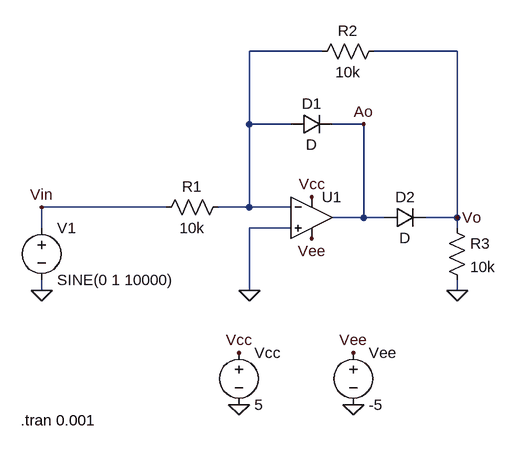
[diagram p0: schematic PrecisionHalfWaveRectifier.asc]
PrecisionHalfWaveRectifier.asc, the LTspice schematic file:
Version 4
SHEET 1 880 680
WIRE 224 -112 112 -112
WIRE 432 -112 304 -112
WIRE 112 0 112 -112
WIRE 176 0 112 0
WIRE 288 0 240 0
WIRE -16 128 -208 128
WIRE 112 128 112 0
WIRE 112 128 64 128
WIRE 176 128 112 128
WIRE 288 144 288 0
WIRE 288 144 240 144
WIRE 320 144 288 144
WIRE 432 144 432 -112
WIRE 432 144 384 144
WIRE -208 160 -208 128
WIRE 176 160 112 160
WIRE 432 160 432 144
WIRE -208 256 -208 240
WIRE 112 256 112 160
WIRE 432 256 432 240
FLAG 96 432 0
FLAG 272 432 0
FLAG 208 112 Vcc
FLAG 208 176 Vee
FLAG 112 256 0
FLAG -208 256 0
FLAG 432 256 0
FLAG 432 144 Vo
FLAG -208 128 Vin
FLAG 288 0 Ao
FLAG 96 352 Vcc
FLAG 272 352 Vee
SYMBOL OpAmps\\UniversalOpAmp 208 144 R0
SYMATTR InstName U1
SYMBOL voltage 96 336 R0
WINDOW 123 0 0 Left 0
WINDOW 39 0 0 Left 0
SYMATTR InstName Vcc
SYMATTR Value 5
SYMBOL voltage 272 336 R0
WINDOW 123 0 0 Left 0
WINDOW 39 0 0 Left 0
SYMATTR InstName Vee
SYMATTR Value -5
SYMBOL voltage -208 144 R0
WINDOW 123 0 0 Left 0
WINDOW 39 0 0 Left 0
SYMATTR InstName V1
SYMATTR Value SINE(0 1 10000)
SYMBOL res 80 112 R90
WINDOW 0 0 56 VBottom 2
WINDOW 3 32 56 VTop 2
SYMATTR InstName R1
SYMATTR Value 10k
SYMBOL res 320 -128 R90
WINDOW 0 0 56 VBottom 2
WINDOW 3 32 56 VTop 2
SYMATTR InstName R2
SYMATTR Value 10k
SYMBOL res 416 144 R0
SYMATTR InstName R3
SYMATTR Value 10k
SYMBOL diode 176 16 R270
WINDOW 0 32 32 VTop 2
WINDOW 3 0 32 VBottom 2
SYMATTR InstName D1
SYMBOL diode 320 160 R270
WINDOW 0 32 32 VTop 2
WINDOW 3 0 32 VBottom 2
SYMATTR InstName D2
TEXT -240 456 Left 2 !.tran 0.001

The netlist it stands for:
* PrecisionHalfWaveRectifier.asc
XU1 0 N001 Vcc Vee Ao level1 Avol=1Meg GBW=10Meg Vos=0 En=0 Enk=0 In=0 Ink=0 Rin=500Meg  ; pins In+ In- V+ V- OUT
Vcc Vcc 0 5
Vee Vee 0 -5
V1 Vin 0 SINE(0 1 10000)
R1 N001 Vin 10k
R2 Vo N001 10k
R3 Vo 0 10k
D1 N001 Ao D
D2 Ao Vo D
.model D D
.lib standard.dio
.tran 0.001
.lib UniversalOpAmp1.lib
.backanno
.end